# EAGLE schematic GPS_radiologger_v20_CAM_M8Q (EAGLE 9.6.2)
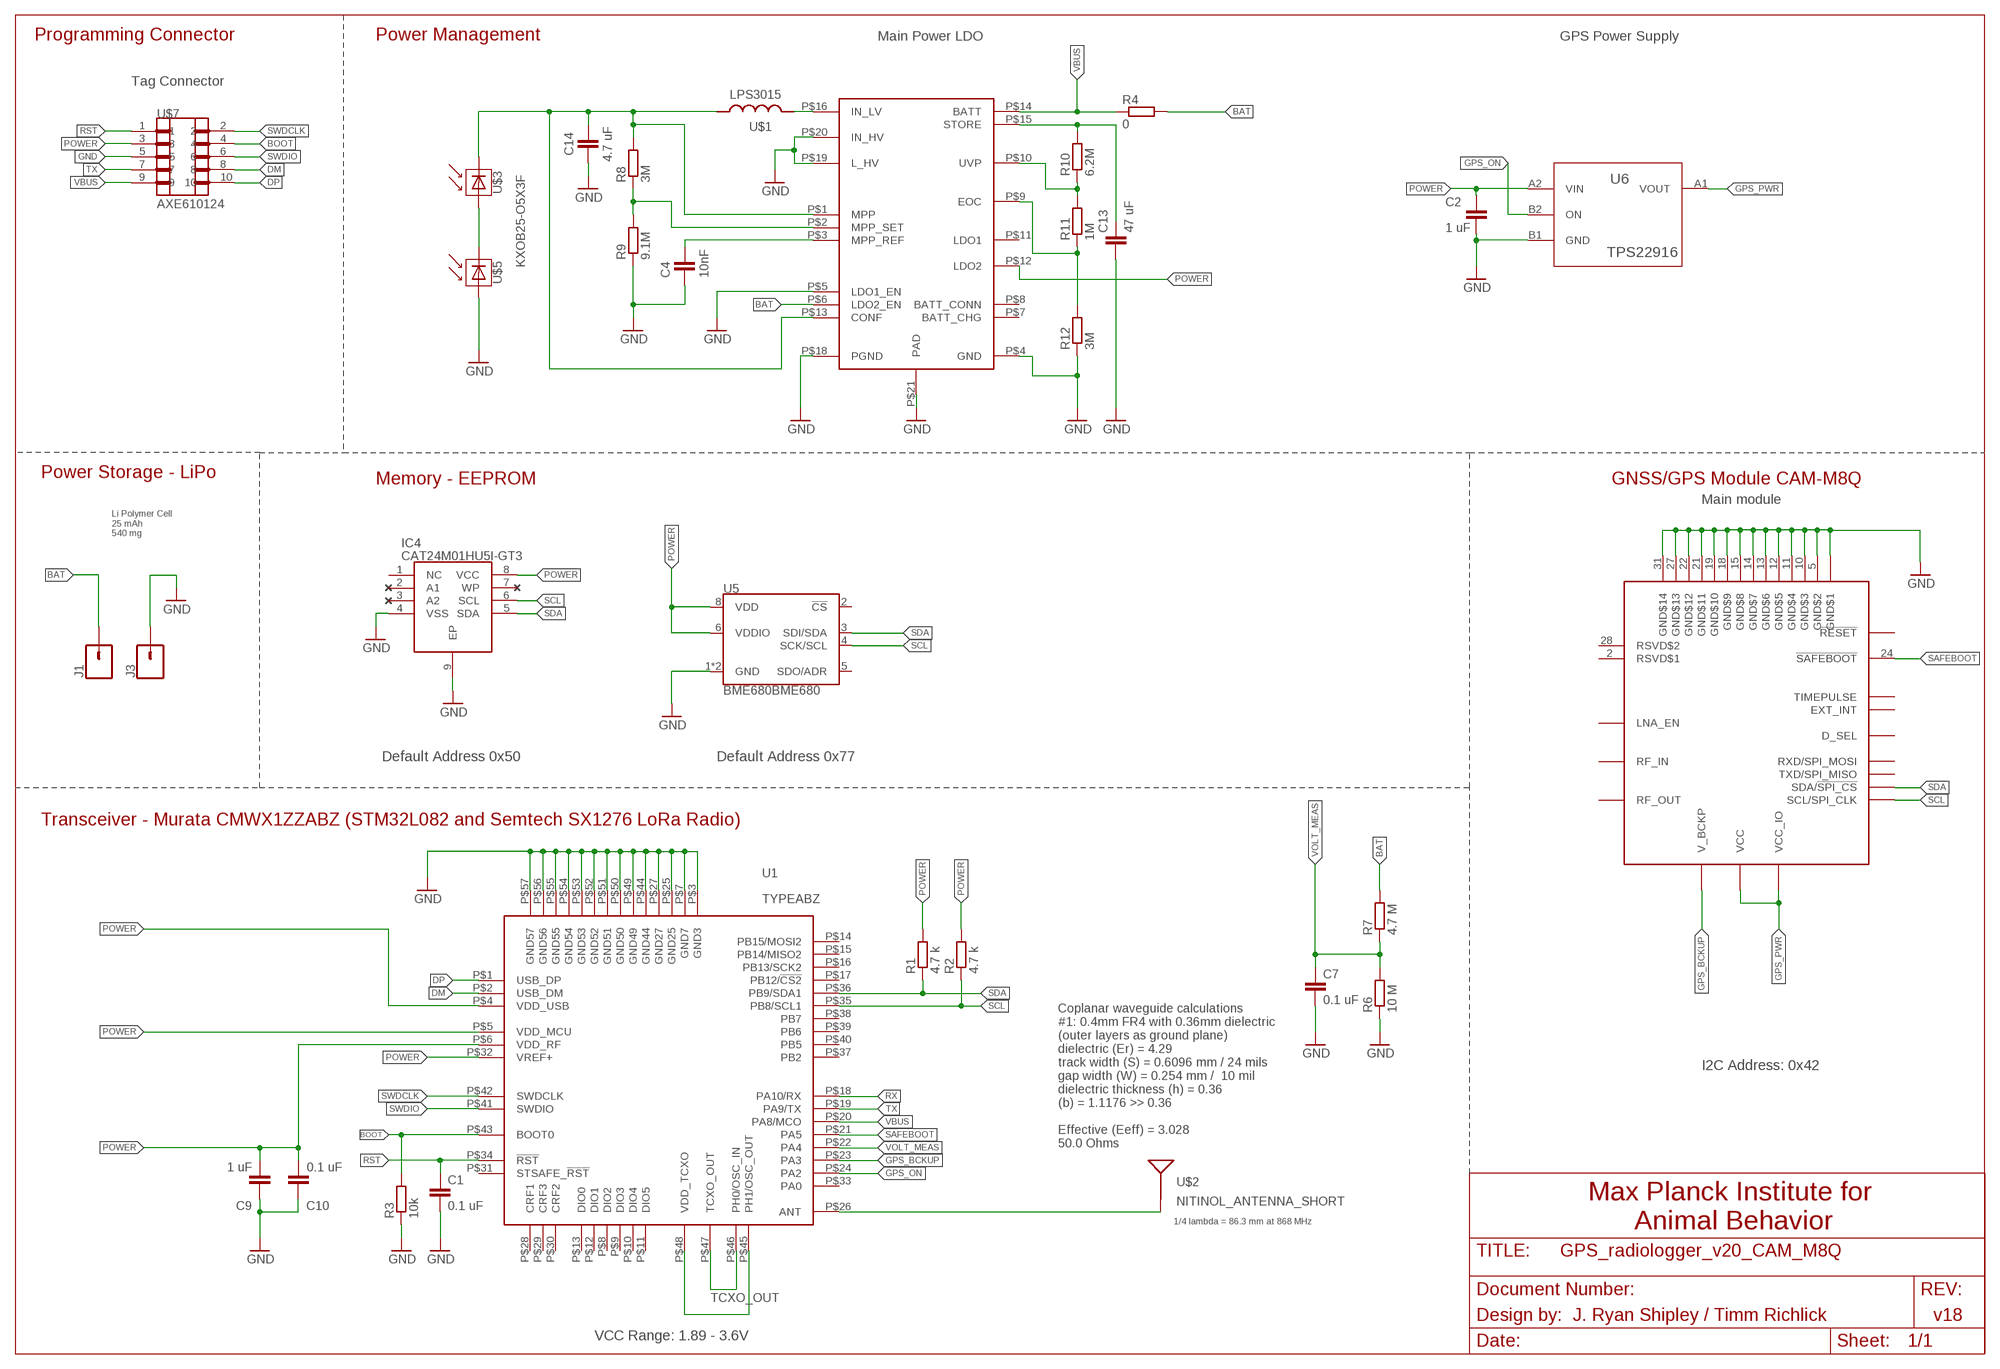
[diagram p0: schematic, sheet 1]

## Parts
C1  0.1 uF  C-EUC0201  [C0201]
C2  1 uF  C-EUC0201  [C0201]
C4  10nF  C-EUC0201  [C0201]
C7  0.1 uF  C-EUC0201  [C0201]
C9  1 uF  C-EUC0201  [C0201]
C10  0.1 uF  C-EUC0201  [C0201]
C13  47 uF  C-EUC0805K  [C0805K]
C14  4.7 uF  C-EUC0201  [C0201]
IC4  CAT24M01HU5I-GT3  [SON50P300X200X55-9N]
J1  CONN_01PTH_NO_SILK_YES_STOP  [1X01_NO_SILK]
J3  CONN_01PTH_NO_SILK_YES_STOP  [1X01_NO_SILK]
R1  4.7 k  R-EU_R0201  [R0201]
R2  4.7 k  R-EU_R0201  [R0201]
R3  10k  R-EU_R0201  [R0201]
R4  0  R-EU_R0201  [R0201]
R6  10 M  R-EU_R0201  [R0201]
R7  4.7 M  R-EU_R0201  [R0201]
R8  3M  R-EU_R0201  [R0201]
R9  9.1M  R-EU_R0201  [R0201]
R10  6.2M  R-EU_R0201  [R0201]
R11  1M  R-EU_R0201  [R0201]
R12  3M  R-EU_R0201  [R0201]
U1  TYPEABZ  [TYPEABZ]
U4  SPV1050  [SPV1050]
U5  BME680BME680  [LGA3.0X3.0]
U6  TPS22916  [TPS22916]
U$1  LPS3015  [LPS_3015]
U$2  NITINOL_ANTENNA_SHORT  [ICARUS_NITINOL_ANTENNA_SHORT]
U$3  KXOB25-O5X3F  [KXOB25-05X3F]
U$4  CAM-M8  [CAM-M8]
U$5  KXOB25-O5X3F  [KXOB25-05X3F]
U$7  AXE610124  [AXE610124]

## Nets
BAT [battery]: J1.1 R4.2 R7.2 U4.P$6(LDO2_EN)
BOOT: R3.2 U1.P$43(BOOT0) U$7.4
DM: U1.P$2(USB_DM) U$7.8
DP: U1.P$1(USB_DP) U$7.10
GND: C1.2 C2.2 C4.2 C7.2 C9.1 C10.1 C13.2 C14.2 IC4.4(VSS) IC4.9(EP) J3.1 R3.1 R6.1 R9.1 R12.1 U1.P$3(GND3) U1.P$7(GND7) U1.P$25(GND25) U1.P$27(GND27) U1.P$44(GND44) U1.P$49(GND49) U1.P$50(GND50) U1.P$51(GND51) U1.P$52(GND52) U1.P$53(GND53) U1.P$54(GND54) U1.P$55(GND55) U1.P$56(GND56) U1.P$57(GND57) U4.P$4(GND) U4.P$5(LDO1_EN) U4.P$18(PGND) U4.P$19(L_HV) U4.P$20(IN_HV) U4.P$21(PAD) U5.1(GND) U5.7(GND) U6.B1(GND) U$4.4(GND$1) U$4.5(GND$2) U$4.10(GND$3) U$4.11(GND$4) U$4.12(GND$5) U$4.13(GND$6) U$4.14(GND$7) U$4.15(GND$8) U$4.18(GND$9) U$4.19(GND$10) U$4.21(GND$11) U$4.22(GND$12) U$4.27(GND$13) U$4.31(GND$14) U$5.P$2(MINUS) U$7.5
GPS_BCKUP: U1.P$23(PA3) U$4.8(V_BCKP)
GPS_ON: U1.P$24(PA2) U6.B2(ON)
GPS_PWR: U6.A1(VOUT) U$4.1(VCC_IO) U$4.9(VCC)
N$1: U1.P$45(PH1/OSC_OUT) U1.P$48(VDD_TCXO)
N$2: U$3.P$2(MINUS) U$5.P$1(PLUS)
N$4: U4.P$16(IN_LV) U$1.P$2
N$6: R8.1 R9.2 U4.P$2(MPP_SET)
N$7 [battery]: C14.1 R8.2 U4.P$1(MPP) U4.P$13(CONF) U$1.P$1 U$3.P$1(PLUS)
N$8: R10.1 R11.2 U4.P$10(UVP)
N$9: R11.1 R12.2 U4.P$9(EOC)
N$11 [antenna]: U1.P$26(ANT) U$2.1(SIGNAL) U$2.2(SIGNAL) U$2.3(SIGNAL)
N$12: C13.1 R10.2 U4.P$15(STORE)
N$13: C4.1 U4.P$3(MPP_REF)
POWER [power]: C2.1 C9.2 C10.2 IC4.8(VCC) R1.2 R2.2 U1.P$4(VDD_USB) U1.P$5(VDD_MCU) U1.P$6(VDD_RF) U1.P$32(VREF+) U4.P$12(LDO2) U5.6(VDDIO) U5.8(VDD) U6.A2(VIN) U$7.3
RST: C1.1 U1.P$34(!RST) U$7.1
RX: U1.P$18(PA10/RX)
SAFEBOOT: U1.P$21(PA5) U$4.24(!SAFEBOOT)
SCL: IC4.6(SCL) R2.1 U1.P$35(PB8/SCL1) U5.4(SCK/SCL) U$4.6(SCL/SPI_CLK)
SDA: IC4.5(SDA) R1.1 U1.P$36(PB9/SDA1) U5.3(SDI/SDA) U$4.3(SDA/!SPI_CS)
SWDCLK: U1.P$42(SWDCLK) U$7.2
SWDIO: U1.P$41(SWDIO) U$7.6
TCXO_OUT: U1.P$46(PH0/OSC_IN) U1.P$47(TCXO_OUT)
TX: U1.P$19(PA9/TX) U$7.7
VBUS: R4.1 U1.P$20(PA8/MCO) U4.P$14(BATT) U$7.9
VOLT_MEAS: C7.1 R6.2 R7.1 U1.P$22(PA4)
Unconnected: IC4.1(NC) IC4.2(A1) IC4.3(A2) IC4.7(WP) U1.P$8(DIO2) U1.P$9(DIO3) U1.P$10(DIO4) U1.P$11(DIO5) U1.P$12(DIO1) U1.P$13(DIO0) U1.P$14(PB15/MOSI2) U1.P$15(PB14/MISO2) U1.P$16(PB13/SCK2) U1.P$17(PB12/!CS2) U1.P$28(CRF1) U1.P$29(CRF3) U1.P$30(CRF2) U1.P$31(STSAFE_!RST) U1.P$33(PA0) U1.P$37(PB2) U1.P$38(PB7) U1.P$39(PB6) U1.P$40(PB5) U4.P$7(BATT_CHG) U4.P$8(BATT_CONN) U4.P$11(LDO1) U5.2(!CS) U5.5(SDO/ADR) U$4.2(RSVD$1) U$4.7(EXT_INT) U$4.16(RF_OUT) U$4.17(RF_IN) U$4.20(D_SEL) U$4.23(!RESET) U$4.25(TXD/SPI_MISO) U$4.26(RXD/SPI_MOSI) U$4.28(RSVD$2) U$4.29(TIMEPULSE) U$4.30(LNA_EN)

## Notes on the sheet
- Programming Connector | Power Management | Main Power LDO | GPS Power Supply
- Tag Connector
- Power Storage - LiPo
- Memory - EEPROM | GNSS/GPS Module CAM-M8Q
- Main module
- Li Polymer Cell
  25 mAh
  540 mg
- Default Address 0x50 | Default Address 0x77
- Transceiver - Murata CMWX1ZZABZ (STM32L082 and Semtech SX1276 LoRa Radio)
- I2C Address: 0x42
- Coplanar waveguide calculations
  #1: 0.4mm FR4 with 0.36mm dielectric 
  (outer layers as ground plane)
  dielectric (Er) = 4.29
  track width (S) = 0.6096 mm / 24 mils
  gap width (W) = 0.254 mm /  10 mil
  dielectric thickness (h) = 0.36
  (b) = 1.1176 >> 0.36
  
  Effective (Eeff) = 3.028
  50.0 Ohms
- Max Planck Institute for 
  Animal Behavior
- 1/4 lambda = 86.3 mm at 868 MHz
- Design by: | J. Ryan Shipley / Timm Richlick | v18
- VCC Range: 1.89 - 3.6V

## Library data of the parts
C1 C2 C4 C7 C9 C10 C13 C14 = rcl:C-EU: CAPACITOR, European symbol; SPICEPREFIX: C
IC4 = CAT24M01HU5I-GT3-CorrectedV2:CAT24M01HU5I-GT3: EEPROM 1MB I2C SERIAL EEPROM Source: Datasheet <http://www.onsemi.com/pub/Collateral/CAT24M01-D.PDF>; ALLIED_NUMBER: 70300250; ALLIED_PRICE-STOCK: http://www.alliedelec.com/on-semiconductor-cat24m01hu5i-gt3/70300250/; DESCRIPTION: EEPROM 1MB I2C SERIAL EEPROM; HEIGHT: 0.55mm; MANUFACTURER_NAME: ON Semiconductor; MANUFACTURER_PART_NUMBER: CAT24M01HU5I-GT3; MOUSER_PART_NUMBER: 863-CAT24M01HU5I-GT3; MOUSER_PRICE-STOCK: https://www.mouser.com/Search/Refine.aspx?Keyword=863-CAT24M01HU5I-GT3; RS_PART_NUMBER: 7814831P; RS_PRICE-STOCK: http://uk.rs-online.com/web/p/products/7814831P
J1 J3 = SparkFun-Connectors:CONN_01: Single connection point. Often used as Generic Header-pin footprint for 0.1 inch spaced/style header connections On any of the 0.1 inch spaced packages, you can populate with these: Break Away Headers - Straight <https://www.sparkfun.com/products/116> (PRT-00116) Break Away Male Headers - Right Angle <https://www.sparkfun.com/products/553> (PRT-00553) Female Headers <https://www.sparkfun.com/products/115> (PRT-00115) Break Away Headers - Machine Pin <https://www.sparkfun.com/products/117> (PRT-00117) Break Away Female Headers - Swiss Machine Pin <https://www.sparkfun.com/products/743> (PRT-00743) This device is also useful as a general connection point to wire up your design to another part of your project. Our various solder wires solder well into these plated through hole pads. Hook-Up Wire - Assortment (Stranded, 22 AWG) <https://www.sparkfun.com/products/11375> (PRT-11375) Hook-Up Wire - Assortment (Solid Core, 22 AWG) <https://www.sparkfun.com/products/11367> (PRT-11367) View the entire wire category on our website here <https://www.sparkfun.com/categories/141> Special notes: SMTSO-256-ET is a "flush mount" nut for a 4-40 screw. We mostly use this on specialty testbeds; it is a nice way to connect hardware to your PCB at an adjustable hieght. Also note, the SNAP packages are for using a snappable style connector. We sell a baggie of snaps and they are also used on two LilyPad designs: Snap Assortment - 30 pack (male and female) <https://www.sparkfun.com/products/11347> (DEV-11347) LilyPad Arduino SimpleSnap <https://www.sparkfun.com/products/10941> (DEV-10941) LilyPad SimpleSnap Protoboard <https://www.sparkfun.com/products/10940> (DEV-10940)
R1-R4 R6-R12 = rcl:R-EU_: RESISTOR, European symbol; SPICEPREFIX: R
U1 = Kris:TYPEABZ: CMWX1ZZABZ-078
U4 = STM-SPV1050_V2:SPV1050
U5 = SparkFun-Sensors:BME680: Bosch BME680 – Combined Humidity and Pressure Sensor The BME680 is as combined digital humidity, pressure and temperature sensor based on proven sensing principles. The sensor module is housed in an extremely compact metal-lid LGA package with a footprint of only 3.0×3.0mm with a height of 0.93mm. Its small dimensions and its low power consumption allow the implementation in battery driven devices such as handsets, GPS modules or watches.; PROD_ID: IC-14656
U6 = TPS22916V2:TPS22916: Linear Regulator; AVAILABILITY: Unavailable; DESCRIPTION: Linear Voltage Regulator IC 1 Output 150mA 4-DSBGA (1x1); MF: Texas Instruments; MP: LP5900TL-3.0; PACKAGE: WFBGA-4 Texas Instruments; PRICE: None
U$1 = coilcraft_custom:LPS3015
U$2 = Antenna_mounts:NITINOL_ANTENNA_SHORT
U$3 U$5 = AnySolar:KXOB25-O5X3F
U$4 = ubloxLib:CAM-M8: CAM-M8x: M8 Concurrent GNSS Antenna Module u-blox.com
U$7 = PanasonicA4SConnectorsV7:AXE610124

## Net classes
1 power: width 0.152 mm
2 antenna: width 0.61 mm, clearance 0.254 mm
3 battery: width 0.152 mm